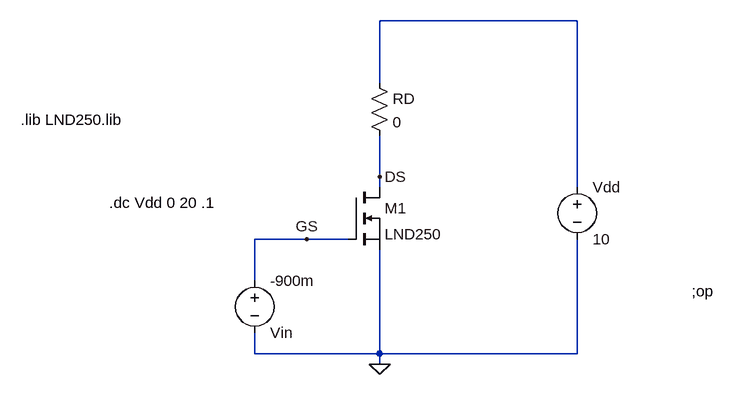
[diagram p0: schematic MOSFETd-schematics.asc]
MOSFETd-schematics.asc, the LTspice schematic file:
Version 4
SHEET 1 880 680
WIRE 528 -256 224 -256
WIRE 224 -160 224 -256
WIRE 224 -16 224 -80
WIRE 224 0 224 -16
WIRE 528 0 528 -256
WIRE 112 80 32 80
WIRE 176 80 112 80
WIRE 32 144 32 80
WIRE 32 256 32 224
WIRE 224 256 224 96
WIRE 224 256 32 256
WIRE 528 256 528 80
WIRE 528 256 224 256
WIRE 224 272 224 256
FLAG 224 272 0
FLAG 224 -16 DS
FLAG 112 80 GS
SYMBOL voltage 32 128 R0
WINDOW 0 24 96 Left 2
WINDOW 3 24 16 Left 2
WINDOW 123 0 0 Left 0
WINDOW 39 0 0 Left 0
SYMATTR InstName Vin
SYMATTR Value -900m
SYMBOL voltage 528 -16 R0
WINDOW 123 0 0 Left 0
WINDOW 39 0 0 Left 0
SYMATTR InstName Vdd
SYMATTR Value 10
SYMBOL res 208 -176 R0
SYMATTR InstName RD
SYMATTR Value 0
SYMBOL nmos 176 0 R0
SYMATTR InstName M1
SYMATTR Value LND250
TEXT -328 -104 Left 2 !.lib LND250.lib
TEXT -192 24 Left 2 !.dc Vdd 0 20 .1
TEXT 704 160 Left 2 !;op

The netlist it stands for:
* MOSFETd-schematics.asc
Vin GS 0 -900m
Vdd N001 0 10
RD N001 DS 0
M1 DS GS 0 0 LND250
.model NMOS NMOS
.model PMOS PMOS
.lib standard.mos
.lib LND250.lib
.dc Vdd 0 20 .1
;op
.backanno
.end